# Altium schematic sheet 1_Schematic.schdoc.schdoc
size 309 x 223 mm; Symbol: Sheet-Symbol_A4; Device: Sheet-Symbol_A4; @Project Name: USB-C Power Supply_kido; @Page Count: 1; @Update Date: 2024-03-10; @Create Date: 2024-03-10; @Schematic Name: USB-C Power Supply_kido; @Page No: 1; @Page Name: Schematic; Company: https://litt.ly/syskido; Reviewed: EasyEDA; Version: V0.1; Page Size: A4; Part Number: KIDO-0001; Drawn: syskido_kido
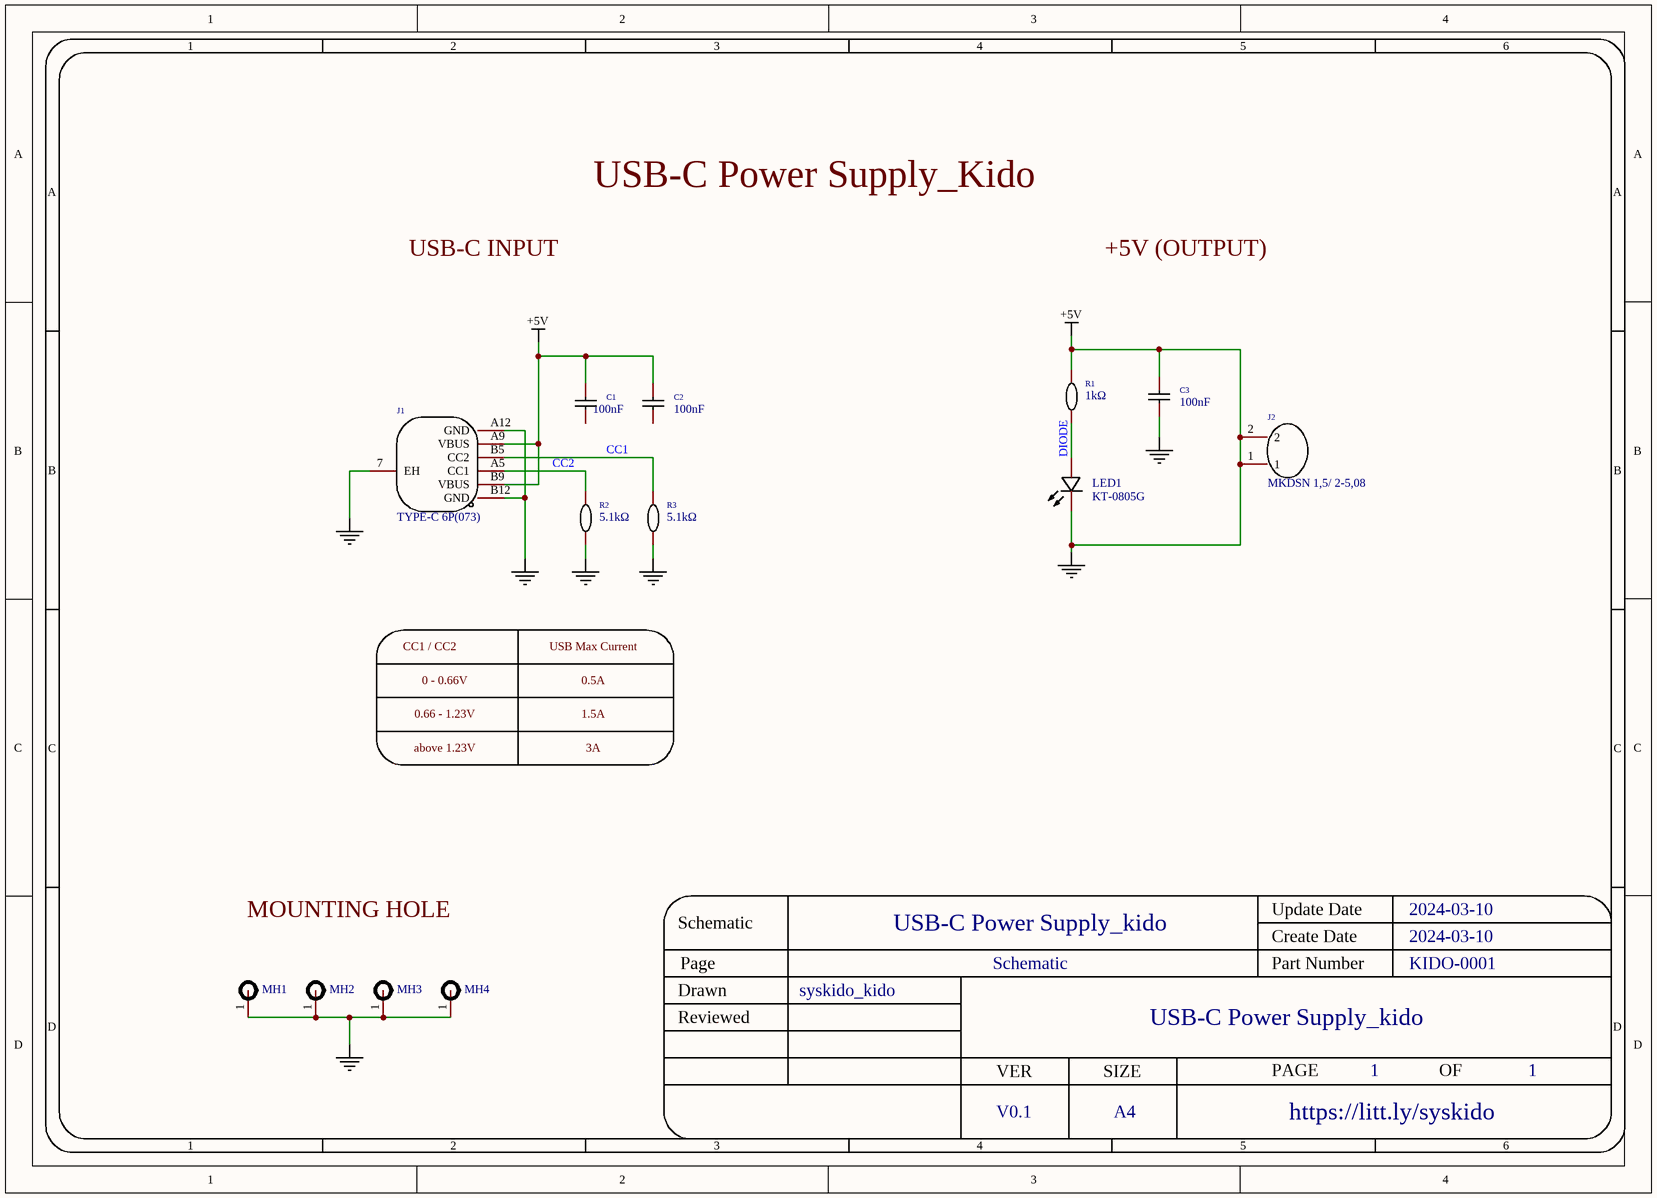
[diagram p0: 1_Schematic.schdoc.schdoc]

## Parts
C1  100nF  [C0805]
C2  100nF  [C0805]
C3  100nF  [C0805]
J1  TYPE-C 6P(073)  [TYPE-C-SMD_TYPE-C-6P]
J2  MKDSN 1,5/ 2-5,08  [CONN-TH_2P-P5.08_1729128]
LED1  KT-0805G  [LED0805-R-RD]
MH1  MH_7.5x2.7MM  [MH_7.5X2.7MM]  (value not drawn)
MH2  MH_7.5x2.7MM  [MH_7.5X2.7MM]  (value not drawn)
MH3  MH_7.5x2.7MM  [MH_7.5X2.7MM]  (value not drawn)
MH4  MH_7.5x2.7MM  [MH_7.5X2.7MM]  (value not drawn)
R1  1kΩ  [R0805]
R2  5.1kΩ  [R0805]
R3  5.1kΩ  [R0805]

## Nets
+5V: C1.2 C2.2 C3.2 J1.A9(VBUS) J1.B9(VBUS) J2.1 J2.2 LED1.2(K) R1.2
GND: C3.1 J1.7(EH) J1.A12(GND) J1.B12(GND) MH1.1 MH2.1 MH3.1 MH4.1 R2.1 R3.1
CC1: J1.B5(CC2) R3.2
CC2: J1.A5(CC1) R2.2
DIODE: LED1.1(A) R1.1

Not connected (* = marked no-connect by the designer): C1 1; C2 1

## Notes on the sheet
- USB-C Power Supply_Kido
- USB-C INPUT
- +5V (OUTPUT)
- CC1 / CC2
- 0 - 0.66V
- USB Max Current
- 0.5A
- 0.66 - 1.23V
- above 1.23V
- 1.5A
- 3A
- MOUNTING HOLE
- 1
- 2
- 3
- 4
- 5
- 6
- A
- B
- C
- Schematic
- USB-C Power Supply_kido
- Create Date
- Update Date
- 2024-03-10
- Reviewed
- Drawn
- Page
- syskido_kido
- Part Number
- KIDO-0001
- D
- VER
- SIZE
- PAGE
- OF
- V0.1
- A4
- https://litt.ly/syskido

## Library data of the parts
C1-C3 = CC0805KRX7R9BB104: Manufacturer: YAGEO(国巨); Add into BOM: yes; Tolerance: ±10%; Name: 100nF; Symbol: CC0805KRX7R9BB104; Device: CC0805KRX7R9BB104; Supplier: LCSC; Manufacturer Part: CC0805KRX7R9BB104; Value: 100nF; Supplier Part: C49678; JLCPCB Part Class: Basic Part; LCSC Part Name: 100nF ±10% 50V; Supplier Footprint: 0805; Datasheet: https://atta.szlcsc.com/upload/public/pdf/source/20180224/C181747_15194369449651363981.pdf; Convert to PCB: yes
J1 = TYPE-C 6P(073): Manufacturer: SHOU HAN(首韩); Add into BOM: yes; Gender: Female; Number of Ports: 1; Current Rating - Power (Max): 5A; Name: TYPE-C 6P(073); Symbol: TYPE-C 6P(073); Device: TYPE-C 6P(073); Supplier: LCSC; Supplier Part: C668623; Manufacturer Part: TYPE-C 6P(073); JLCPCB Part Class: Extended Part; LCSC Part Name: Type-C 母 卧贴; Supplier Footprint: SMD; Datasheet: https://atta.szlcsc.com/upload/public/pdf/source/20200618/C668623_A4B260DED7AC1949BAC6AE39E9F4CD80.pdf; Convert to PCB: yes; Connector Type: Type-C; Standard: -; Number of Contacts: 6P; Mounting Style: 卧贴; Operating Temperature Range: -25℃~+85℃
J2 = MKDSN 1,5/ 2-5,08: Manufacturer: Phoenix Contact(菲尼克斯); Add into BOM: yes; Name: MKDSN 1,5/ 2-5,08; Symbol: MKDSN 1,5/ 2-5,08; Device: MKDSN 1,5/ 2-5,08; Supplier: LCSC; Supplier Part: C5183989; Manufacturer Part: MKDSN 1,5/ 2-5,08; JLCPCB Part Class: Extended Part; LCSC Part Name: PCB固定式连接器; Supplier Footprint: 插件,P=5.08mm; Datasheet: https://atta.szlcsc.com/upload/public/pdf/source/20220930/2EBB6F7D796C47B5D3EC7E479654C787.pdf; Convert to PCB: yes
LED1 = KT-0805G: Manufacturer: KENTO; Symbol: 0805G (Green); Add into BOM: yes; Emitted Color: Emerald; Name: KT-0805G; Device: KT-0805G; LCSC Part Name: 0805 翠绿 高亮; Supplier Part: C2297; Manufacturer Part: KT-0805G; Supplier Footprint: 0805; JLCPCB Part Class: Basic Part; Datasheet: https://atta.szlcsc.com/upload/public/pdf/source/20170209/1486607340485.pdf; Supplier: LCSC; Convert to PCB: yes; Lamp Holder Type: -; Forward Voltage (VF): -; Power Dissipation: -; Forward Current: -; Dominant Wavelength: -; Peak Wavelength: -; Diode Configuration: -; Lens Color: -; Color Temperature: -; Luminous Intensity: -; Viewing Angle: -; Mounting Sytle: -; Operating Temperature: -
MH1-MH4 = MH_7.5x2.7MM: Add into BOM: no; Convert to PCB: yes; Symbol: MH_7.5x2.7MM; Device: MH_7.5x2.7MM
R1 = 0805W8F1001T5E: Manufacturer: UNI-ROYAL(厚声); Add into BOM: yes; Tolerance: ±1%; Temperature Coefficient: ±100ppm/℃; Name: 1kΩ; Symbol: 0805W8F1001T5E; Device: 0805W8F1001T5E; Supplier: LCSC; Manufacturer Part: 0805W8F1001T5E; Supplier Part: C17513; Value: 1kΩ; JLCPCB Part Class: Basic Part; LCSC Part Name: 1kΩ ±1% 125mW 厚膜电阻; Supplier Footprint: 0805; Datasheet: https://atta.szlcsc.com/upload/public/pdf/source/20200306/C422600_1E6D84923E4A46A82E41ADD87F860B5C.pdf; Convert to PCB: yes; Type: Thick Film Resistors; Operating Temperature Range: -55℃~+155℃
R2 R3 = 0805W8F5101T5E: Manufacturer: UNI-ROYAL(厚声); Add into BOM: yes; Tolerance: ±1%; Temperature Coefficient: ±100ppm/℃; Name: 5.1kΩ; Symbol: 0805W8F5101T5E; Device: 0805W8F5101T5E; Supplier: LCSC; Manufacturer Part: 0805W8F5101T5E; Supplier Part: C27834; Value: 5.1kΩ; JLCPCB Part Class: Basic Part; LCSC Part Name: 5.1kΩ ±1% 125mW 厚膜电阻; Supplier Footprint: 0805; Datasheet: https://atta.szlcsc.com/upload/public/pdf/source/20200306/C422600_1E6D84923E4A46A82E41ADD87F860B5C.pdf; Convert to PCB: yes; Type: Thick Film Resistors; Operating Temperature Range: -55℃~+155℃